# Altium schematic sheet M8_AUX_CONN.SchDoc: =project_title
size Tabloid; CompanyName: Luxonis Holding; Organization: Luxonis Holding; Address1: 1925 Harmony Park Drive; Address2: Westminster, CO; Address3: 80234; Address4: United States; SheetNumber: 8; SheetTotal: 8
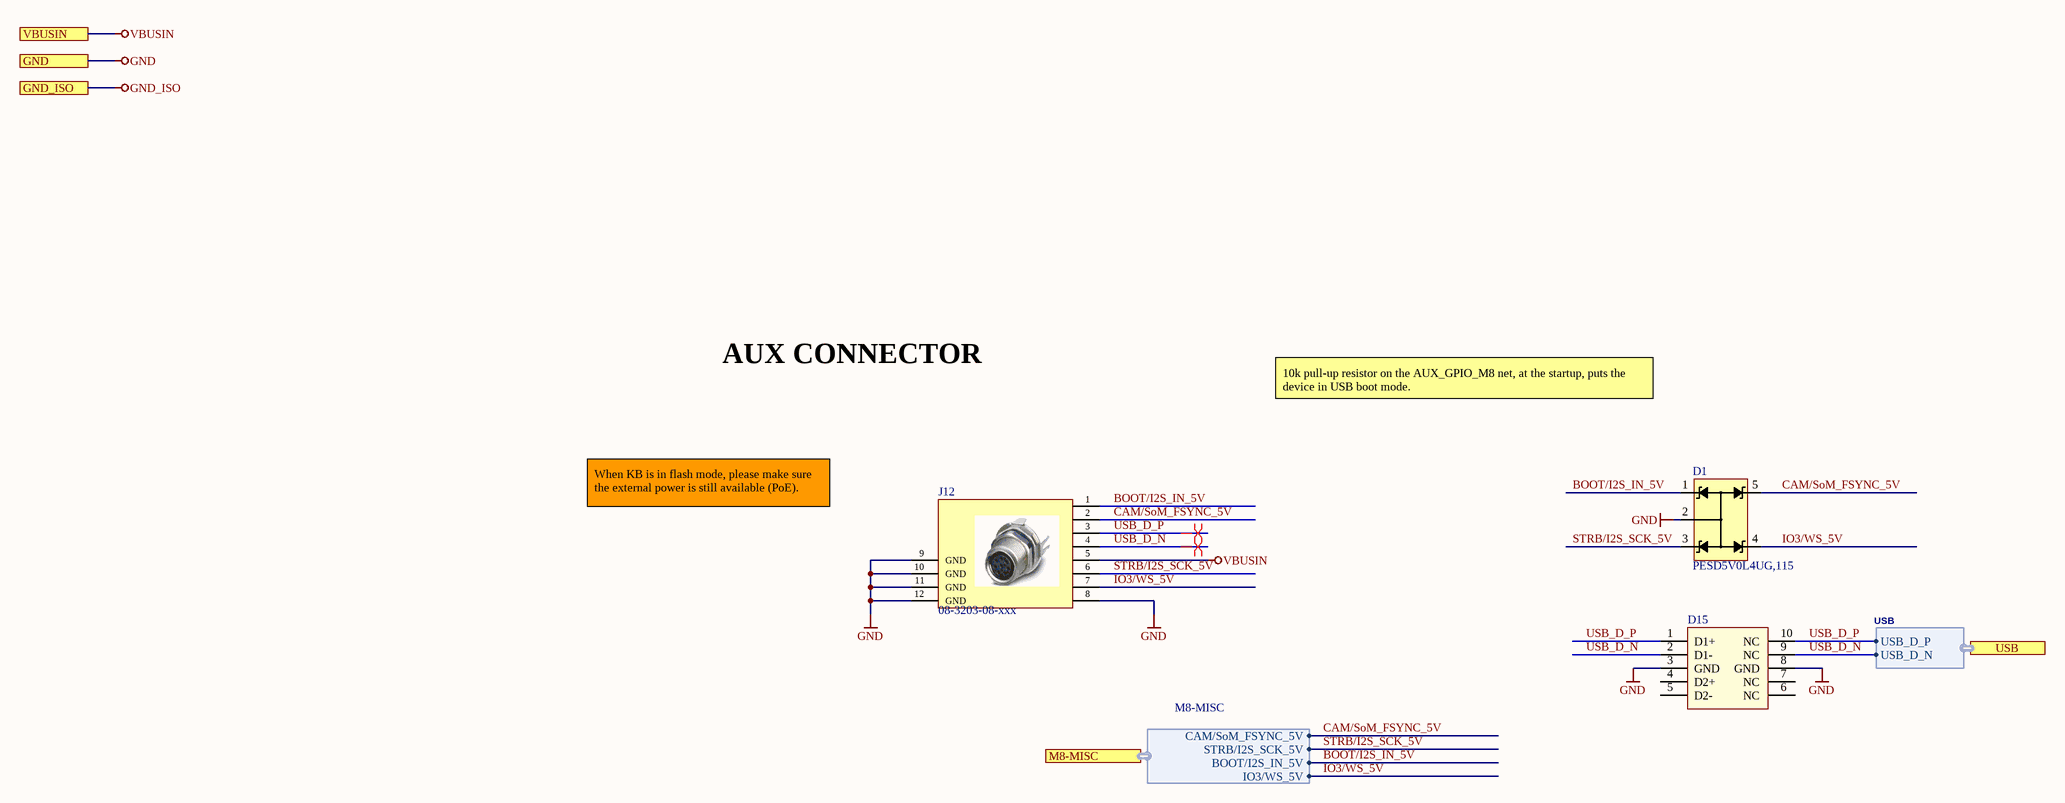
[diagram p0: M8_AUX_CONN.SchDoc]

## Parts
D1  PESD5V0L4UG,115  [PESD3V3L4UG,115]
D15  TPD4EUSB30DQAR  [TPD4EUSB30DQAR]  (value not drawn)
J12  08-3203-08-xxx  [08-3203-08-XXX]

## Ports
GND, GND_ISO, M8-MISC (harness M8-MISC), USB (harness USB), VBUSIN

## Harnesses
USB: USB_D_P, USB_D_N
M8-MISC: CAM/SoM_FSYNC_5V, STRB/I2S_SCK_5V, BOOT/I2S_IN_5V, IO3/WS_5V

## Nets
GND: D1.2 D15.3(GND) D15.8(GND) J12.8 J12.9(GND) J12.10(GND) J12.11(GND) J12.12(GND) ; port GND
GND_ISO: port GND_ISO
VBUSIN: J12.5 ; port VBUSIN
BOOT/I2S_IN_5V: D1.1 J12.1 ; port M8-MISC.BOOT/I2S_IN_5V
CAM/SoM_FSYNC_5V: D1.5 J12.2 ; port M8-MISC.CAM/SoM_FSYNC_5V
IO3/WS_5V: D1.4 J12.7 ; port M8-MISC.IO3/WS_5V
STRB/I2S_SCK_5V: D1.3 J12.6 ; port M8-MISC.STRB/I2S_SCK_5V
USB_D_N: D15.2(D1-) D15.9(NC) J12.4 ; port USB.USB_D_N
USB_D_P: D15.1(D1+) D15.10(NC) J12.3 ; port USB.USB_D_P

Not connected (* = marked no-connect by the designer): D15 4(D2+) 5(D2-) 6(NC) 7(NC)

## Layout directives
differential pair; net class USB2; differential pair class 90ohm: USB_D_N, USB_D_P

## Notes on the sheet
- AUX CONNECTOR
- 10k pull-up resistor on the AUX_GPIO_M8 net, at the startup, puts the device in USB boot mode.
- When KB is in flash mode, please make sure the external power is still available (PoE).
- Title
- Size:
- Date:
- Tabloid
- Number:
- Time:
- Revision:
- Sheet
- of
- Drawn by:

## Library data of the parts
D1 = CMP-097-000002-2: TVS DIODE 5V 12V 5TSSOP; Manufacturer 1: Nexperia; Manufacturer Part Number 1: PESD5V0L4UG,115; Category: ESD and Circuit Protection ICs
D15 = CMP-008-000011-2: TVS DIODE 5.5V 8V 10SON 8V Clamp 1A (8/20µs) Ipp Tvs Diode Surface Mount 10-USON (2.5x1); Manufacturer 1: Texas Instruments; Forward Current: 5A; Manufacturer Part Number 1: TPD4EUSB30DQAR; Min Operating Temperature: -40°C; Max Operating Temperature: 85°C; Clamping Voltage: 8V
J12 = CMP-002-00116-2: M8 Circular Connector; Manufacturer 1: KingTop; RoHS: Yes; Category: Circular Connectors; Contact Finish - Mating: NOT SPECIFIED; Connector Type: Circular; REACH SVHC: No SVHC; RoHS Compliant: Yes; ComponentLink1URL: https://datasheet.ciiva.com:443/pdfs/VipMasterIC/IC/PCON/PCON-S-A0001961096/PCON-S-A0001960825-1.pdf?src-supplier=IHS+Markit; ComponentLink1Description: https://datasheet.ciiva.com:443/pdfs/VipMasterIC/IC/PCON/PCON-S-A0001961096/PCON-S-A0001960825-1.pdf?src-supplier=IHS+Markit; ComponentLink2URL: https://datasheet.ciiva.com/29221/1456132-29221494.pdf?src-supplier=Digi-Key; ComponentLink2Description: https://datasheet.ciiva.com/29221/1456132-29221494.pdf?src-supplier=Digi-Key; ComponentLink3URL: https://datasheet.ciiva.com/41451/718258-da-01-de-sens-akt-einbaubuch-6pol-1456132-20-st-41451463.pdf?src-supplier=Conrad; ComponentLink3Description: https://datasheet.ciiva.com/41451/718258-da-01-de-sens-akt-einbaubuch-6pol-1456132-20-st-41451463.pdf?src-supplier=Conrad; Manufacturer Part Number 1: 08-3203-08-XXX; Stock 1: 11; Pricing 1: 1=26,56000, 10=24,43500, 50=22,57600, 100=21,51360, 250=20,18568 (USD); Design Item ID: 08-3203-08-xxx; Source: NG9097.SchLib; Pins: 8